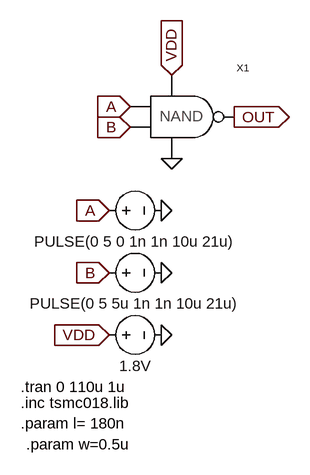
[diagram p0: schematic NANDsim.asc]
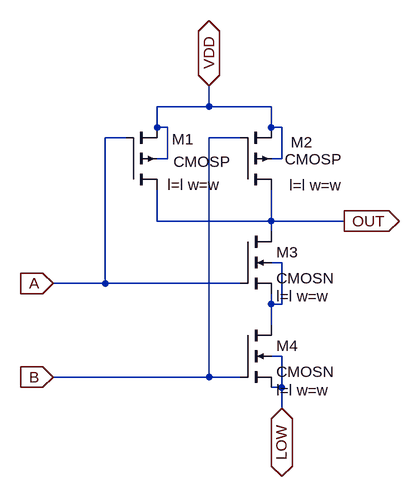
[diagram p1: sub-circuit nand.asc]
NANDsim.asc, the LTspice schematic file:
Version 4
SHEET 1 880 704
FLAG 144 144 A
IOPIN 144 144 In
FLAG 144 176 B
IOPIN 144 176 In
FLAG 208 96 VDD
IOPIN 208 96 In
FLAG 304 160 OUT
IOPIN 304 160 Out
FLAG 208 224 0
FLAG 112 304 A
IOPIN 112 304 In
FLAG 112 400 B
IOPIN 112 400 In
FLAG 112 496 VDD
IOPIN 112 496 In
FLAG 192 304 0
FLAG 192 400 0
FLAG 192 496 0
SYMBOL NAND 224 256 R0
SYMATTR InstName X1
SYMBOL voltage 96 304 R270
WINDOW 0 32 56 Invisible 2
WINDOW 3 -32 56 VBottom 2
WINDOW 123 0 0 Left 0
WINDOW 39 0 0 Left 0
SYMATTR InstName V1
SYMATTR Value PULSE(0 5 0 1n 1n 10u 21u)
SYMBOL voltage 96 400 R270
WINDOW 0 32 56 Invisible 2
WINDOW 3 -32 56 VBottom 2
WINDOW 123 0 0 Left 0
WINDOW 39 0 0 Left 0
SYMATTR InstName V2
SYMATTR Value PULSE(0 5 5u 1n 1n 10u 21u)
SYMBOL voltage 96 496 R270
WINDOW 0 32 56 Invisible 2
WINDOW 3 -32 56 VBottom 2
SYMATTR InstName V3
SYMATTR Value 1.8V
TEXT -24 576 Left 2 !.tran 0 110u 1u
TEXT -24 600 Left 2 !.inc tsmc018.lib
TEXT -24 632 Left 2 !.param l= 180n
TEXT -16 664 Left 2 !.param w=0.5u

nand.asc, the sub-circuit schematic file:
Version 4
SHEET 1 1024 680
WIRE 224 16 224 -16
WIRE 224 16 144 16
WIRE 320 16 224 16
WIRE 144 48 144 16
WIRE 160 48 144 48
WIRE 320 48 320 16
WIRE 336 48 320 48
WIRE 96 64 64 64
WIRE 272 64 224 64
WIRE 160 96 160 48
WIRE 160 96 144 96
WIRE 336 96 336 48
WIRE 336 96 320 96
WIRE 144 192 144 144
WIRE 320 192 320 144
WIRE 320 192 144 192
WIRE 432 192 320 192
WIRE 320 208 320 192
WIRE 336 256 320 256
WIRE 64 288 64 64
WIRE 64 288 -16 288
WIRE 272 288 64 288
WIRE 320 320 320 304
WIRE 336 320 336 256
WIRE 336 320 320 320
WIRE 320 352 320 320
WIRE 336 400 320 400
WIRE 224 432 224 64
WIRE 224 432 -16 432
WIRE 272 432 224 432
WIRE 336 448 336 400
WIRE 336 448 320 448
WIRE 336 480 336 448
FLAG 224 -16 VDD
IOPIN 224 -16 BiDir
FLAG 336 480 LOW
IOPIN 336 480 BiDir
FLAG 432 192 OUT
IOPIN 432 192 Out
FLAG -16 288 A
IOPIN -16 288 In
FLAG -16 432 B
IOPIN -16 432 In
SYMBOL nmos4 272 208 R0
WINDOW 123 56 100 Left 2
SYMATTR Value2 l=l w=w
SYMATTR InstName M3
SYMATTR Value CMOSN
SYMBOL nmos4 272 352 R0
WINDOW 123 56 100 Left 2
SYMATTR Value2 l=l w=w
SYMATTR InstName M4
SYMATTR Value CMOSN
SYMBOL pmos4 96 144 M180
WINDOW 123 64 8 Left 2
WINDOW 0 71 78 Left 2
WINDOW 3 73 43 Left 2
SYMATTR Value2 l=l w=w
SYMATTR InstName M1
SYMATTR Value CMOSP
SYMBOL pmos4 272 144 M180
WINDOW 123 76 7 Left 2
WINDOW 0 78 73 Left 2
WINDOW 3 69 47 Left 2
SYMATTR Value2 l=l w=w
SYMATTR InstName M2
SYMATTR Value CMOSP

The netlist it stands for:
* NANDsim.asc
XX1 VDD 0 A B OUT nand
V1 A 0 PULSE(0 5 0 1n 1n 10u 21u)
V2 B 0 PULSE(0 5 5u 1n 1n 10u 21u)
V3 VDD 0 1.8V

* block symbol definitions
.subckt nand VDD LOW A B OUT
M3 OUT A N001 N001 CMOSN l=l w=w
M4 N001 B LOW LOW CMOSN l=l w=w
M1 OUT A VDD VDD CMOSP l=l w=w
M2 OUT B VDD VDD CMOSP l=l w=w
.ends nand

.model NMOS NMOS
.model PMOS PMOS
.lib standard.mos
.tran 0 110u 1u
.inc tsmc018.lib
.param l= 180n
.param w=0.5u
.backanno
.end

* Results of the author's LTspice run, read from the files saved beside the schematic
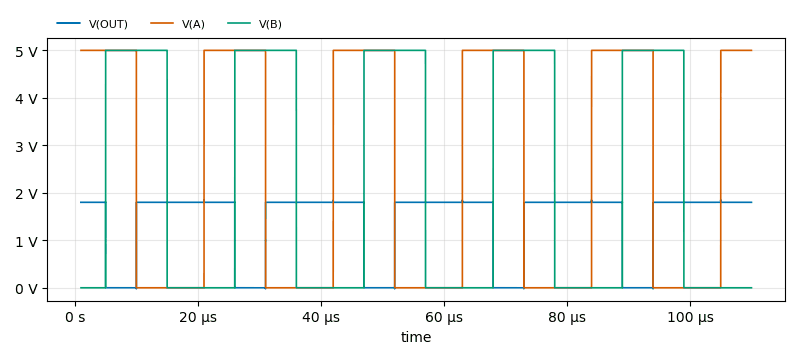
[diagram p2: Transient Analysis of NANDsim.asc, plotted from the saved traces]
* Transient Analysis, 1 run:
*   V(OUT): min -21.58 mV, max 1.849 V, average 1.387 V, rms 1.58 V, last 1.8 V
*   V(A): min 0 V, max 5 V, average 2.477 V, rms 3.519 V, last 5 V
*   V(B): min 0 V, max 5 V, average 2.294 V, rms 3.387 V, last 0 V